# EAGLE schematic board (EAGLE 9.1.2)
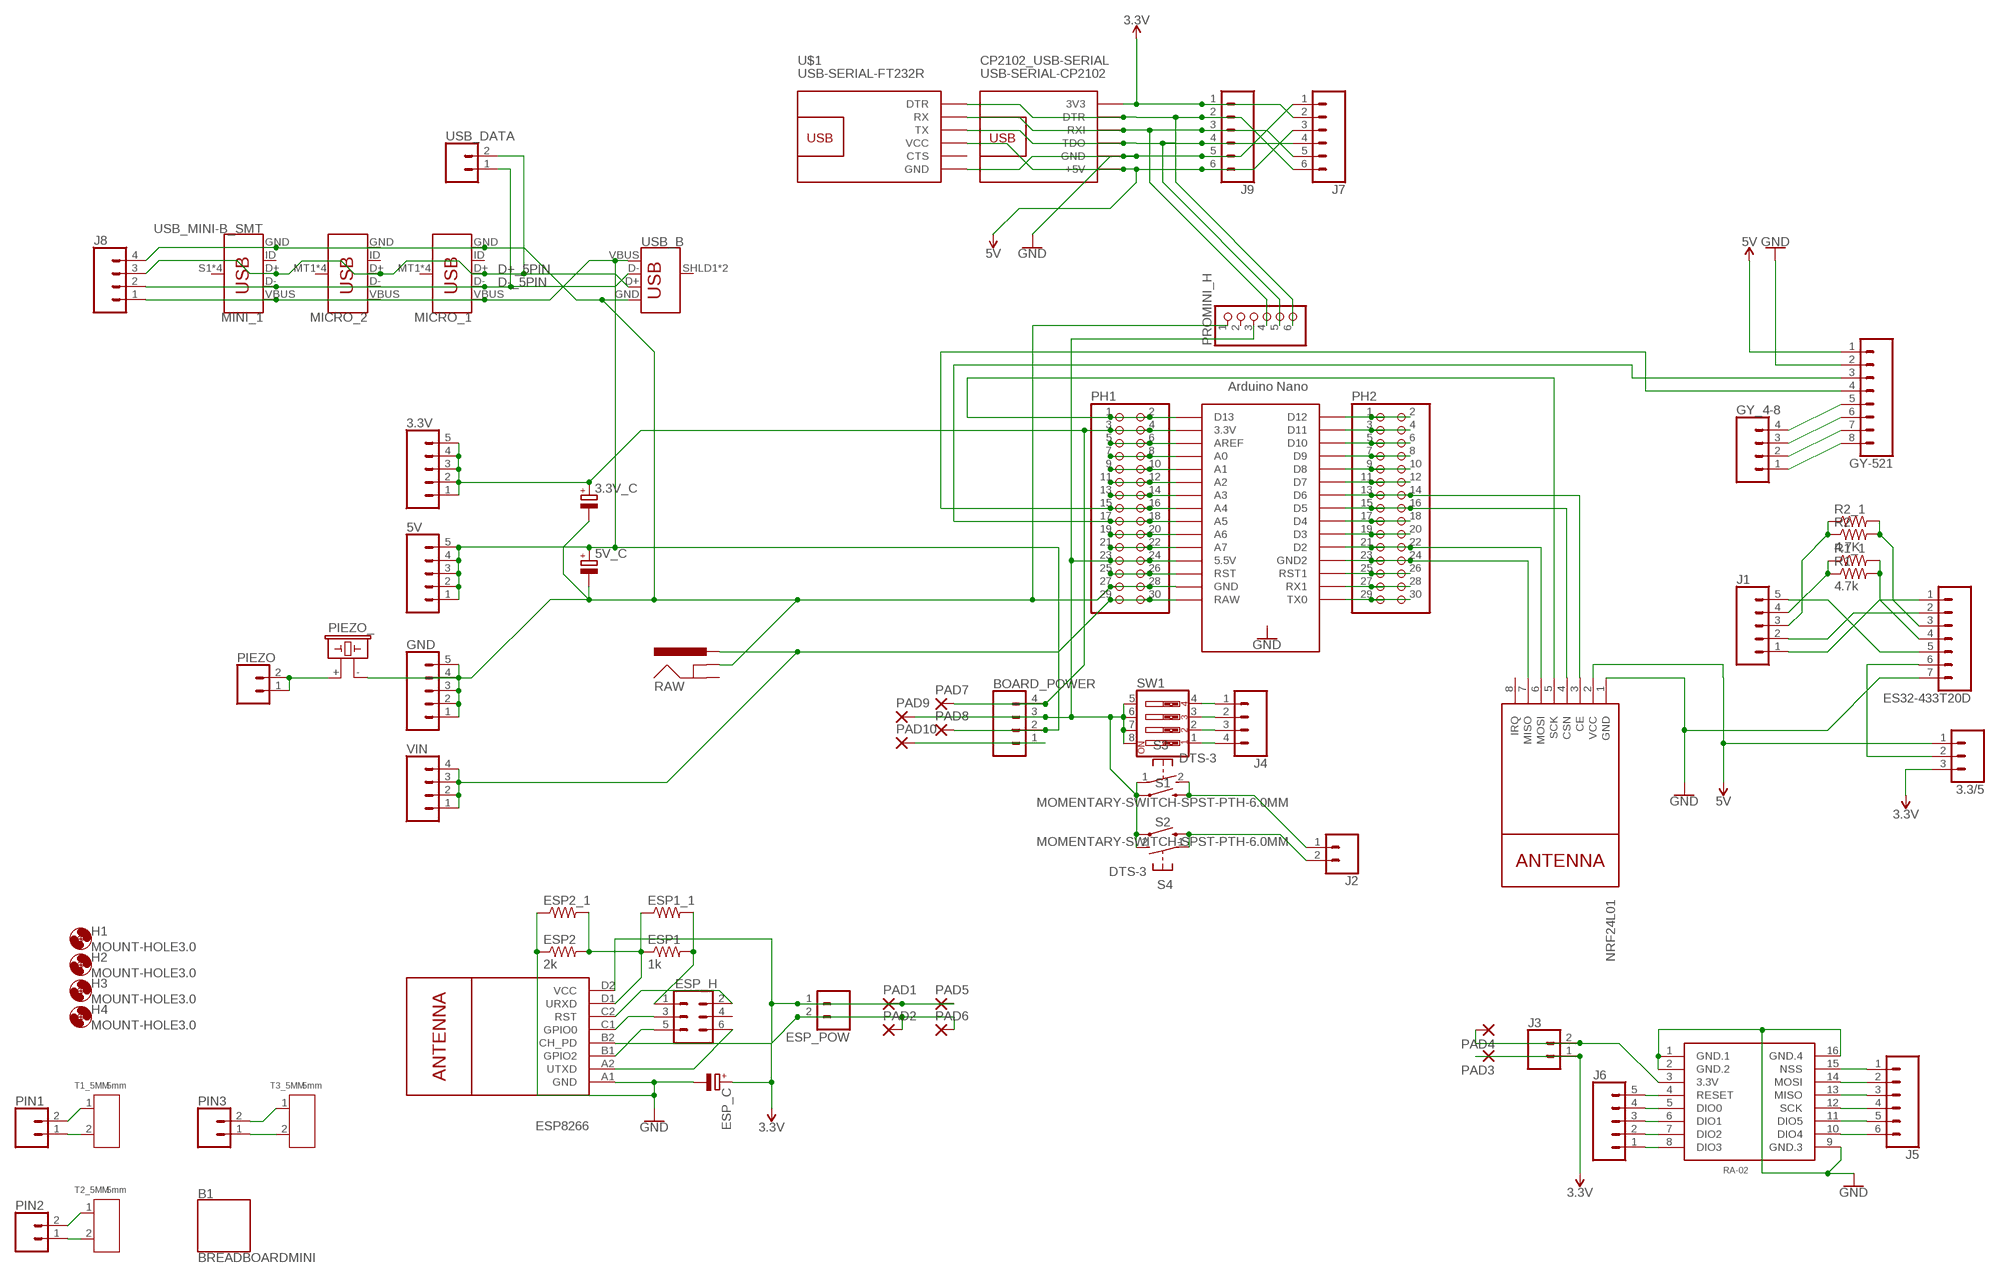
[diagram p0: schematic, sheet 1]

## Parts
3.3/5  CONN_03LOCK  [1X03_LOCK]
3.3V  CONN_05LOCK_LONGPADS  [1X05_LOCK_LONGPADS]
3.3V_C  CPOL-EUE2.5-5  [E2,5-5]
5V  CONN_05LOCK_LONGPADS  [1X05_LOCK_LONGPADS]
5V_C  CPOL-EUE3.5-8  [E3,5-8]
B1  BREADBOARDMINI  [BREADBOARD-MINI]
BOARD_POWER  CONN_04LOCK_LONGPADS  [1X04_LOCK_LONGPADS]
CP2102_USB-SERIAL  USB-SERIAL-CP2102  [USB-SERIAL-CP2102]
ES32-433T20D  CONN_07LOCK  [1X07_LOCK]
ESP1  1k  R-US_0207/7  [0207/7]
ESP1_1  R-US_R2012  [R2012]
ESP2  2k  R-US_0207/7  [0207/7]
ESP2_1  R-US_R2012  [R2012]
ESP8266  WIRELESS-WIFI-ESP-01  [WIRELESS-WIFI-ESP-01]
ESP_C  CPOL-EUE2.5-5  [E2,5-5]
ESP_H  CONN_03X2FEMALE  [2X3]
ESP_POW  CONN_02LOCK  [1X02_LOCK]
GND  CONN_05LOCK_LONGPADS  [1X05_LOCK_LONGPADS]
GY-521  CONN_08LOCK  [1X08_LOCK]
GY_4-8  CONN_04LOCK  [1X04_LOCK]
H1  MOUNT-HOLE3.0  [3,0]
H2  MOUNT-HOLE3.0  [3,0]
H3  MOUNT-HOLE3.0  [3,0]
H4  MOUNT-HOLE3.0  [3,0]
J1  CONN_05LOCK  [1X05_LOCK]
J2  CONN_02LOCK_LONGPADS  [1X02_LOCK_LONGPADS]
J3  CONN_02LOCK_LONGPADS  [1X02_LOCK_LONGPADS]
J4  CONN_04LOCK  [1X04_LOCK]
J5  CONN_06LOCK  [1X06_LOCK]
J6  CONN_05LOCK  [1X05_LOCK]
J7  CONN_06LOCK  [1X06_LOCK]
J8  CONN_04LOCK  [1X04_LOCK]
J9  CONN_06LOCK  [1X06_LOCK]
MICRO_1  USB_MICRO-B_SMT  [USB-MICROB]
MICRO_2  USB_MICRO-B_SMT  [USB-MICROB]
MINI_1  USB_MINI-B_SMT  [USB-MINIB]
NANO  NANO  [NANO]
NRF24L01  WIRELESS-NRF24L01  [WIRELESS-NRF24L01]
PAD1  SMD2  [SMD1,27-2,54]
PAD2  SMD2  [SMD1,27-2,54]
PAD3  SMD2  [SMD1,27-2,54]
PAD4  SMD2  [SMD1,27-2,54]
PAD5  SMD2  [SMD1,27-2,54]
PAD6  SMD2  [SMD1,27-2,54]
PAD7  SMD2  [SMD1,27-2,54]
PAD8  SMD2  [SMD1,27-2,54]
PAD9  SMD2  [SMD1,27-2,54]
PAD10  SMD2  [SMD1,27-2,54]
PH1  PINHD-2X15  [2X15]
PH2  PINHD-2X15  [2X15]
PIEZO  CONN_02LOCK  [1X02_LOCK]
PIEZO_  F/CM12P  [F/CM12P]
PIN1  CONN_02LOCK  [1X02_LOCK]
PIN2  CONN_02LOCK  [1X02_LOCK]
PIN3  CONN_02LOCK  [1X02_LOCK]
PROMINI_H  PINHD-1X6/OCT  [1X06/OCT]
R1  4.7k  R-US_0207/7  [0207/7]
R1_1  R-US_R2012  [R2012]
R2  4.7K  R-US_0207/7  [0207/7]
R2_1  R-US_R2012  [R2012]
RA-02  LORA-RA-02-433MHZ  [LORA-RA2-SMD]
RAW  POWER_JACKSLT  [POWER_JACK_SLOT]
S1  MOMENTARY-SWITCH-SPST-PTH-6.0MM  [TACTILE_SWITCH_PTH_6.0MM]
S2  MOMENTARY-SWITCH-SPST-PTH-6.0MM  [TACTILE_SWITCH_PTH_6.0MM]
S3  DTS-3  [DTS-3]
S4  DTS-3  [DTS-3]
SW1  SW_DIP-4  [EDG-04]
T1_5MM  5mm  SCREW-TERMINAL-GREEN(2P-5.0)  [H2-5.0-10.5X8.0MM]
T2_5MM  5mm  SCREW-TERMINAL-GREEN(2P-5.0)  [H2-5.0-10.5X8.0MM]
T3_5MM  5mm  SCREW-TERMINAL-GREEN(2P-5.0)  [H2-5.0-10.5X8.0MM]
U$1  USB-SERIAL-FT232R  [USB-SERIAL-FT232R]
USB_B  USB_B_PTH  [USB-B-PTH]
USB_DATA  CONN_02LOCK  [1X02_LOCK]
VIN  CONN_04LOCK_LONGPADS  [1X04_LOCK_LONGPADS]

## Nets
3.3V [power]: 3.3/5.3 3.3V.1 3.3V.2 3.3V.3 3.3V.4 3.3V.5 3.3V_C.+ BOARD_POWER.4 CP2102_USB-SERIAL.1(3V3) ESP8266.D2(VCC) ESP_C.+ ESP_POW.1 J3.1 J7.2 J9.1 NANO.3.3V PAD1.1(P) PAD3.1(P) PAD5.1(P) PAD7.1(P) PH1.3 PH1.4
5V [power]: 3.3/5.1 5V.1 5V.2 5V.3 5V.4 5V.5 5V_C.+ BOARD_POWER.2 CP2102_USB-SERIAL.6(+5V) GY-521.1 J7.3 J8.1 J9.6 MICRO_1.VBUS MICRO_2.VBUS MINI_1.VBUS NRF24L01.2(VCC) PAD8.1(P) U$1.4(VCC) USB_B.VBUS
A5: GY-521.3 NANO.A5 PH1.17 PH1.18
A6: NANO.A6 PH1.19 PH1.20
A7: NANO.A7 PH1.21 PH1.22
CE_NRF: NANO.D6 NRF24L01.3(CE) PH2.13 PH2.14
CSN_NRF: NANO.D5 NRF24L01.4(CSN) PH2.15 PH2.16
D+_5PIN: J8.3 MICRO_1.D+ MICRO_2.D+ MINI_1.D+ USB_B.D+ USB_DATA.2
D-_5PIN: J8.2 MICRO_1.D- MICRO_2.D- MINI_1.D- USB_B.D- USB_DATA.1
GND [power]: 3.3V_C.- 5V_C.- CP2102_USB-SERIAL.5(GND) ES32-433T20D.7 ESP2.1 ESP2_1.1 ESP8266.A1(GND) ESP_C.- GY-521.2 J7.1 J8.4 J9.5 MICRO_1.GND MICRO_2.GND MINI_1.GND NANO.GND NANO.ICSP6 NRF24L01.1(GND) PH1.27 PH1.28 PIEZO_.- PROMINI_H.1 RA-02.1(GND.1) RA-02.2(GND.2) RA-02.9(GND.3) RA-02.16(GND.4) RAW.GND@1(GNDBREAK) U$1.6(GND) USB_B.GND
MISO_NRF: NANO.GND1(GND2) NRF24L01.7(MISO) PH2.23 PH2.24
MOSI_NRF: NANO.D2 NRF24L01.6(MOSI) PH2.21 PH2.22
N$1: ES32-433T20D.2 J1.2
N$2: GY-521.5 GY_4-8.4
N$3: NANO.AREF PH1.5 PH1.6
N$4: NANO.A0 PH1.7 PH1.8
N$5: NANO.A1 PH1.9 PH1.10
N$6: NANO.A2 PH1.11 PH1.12
N$7: NANO.A3 PH1.13 PH1.14
N$8: GY-521.6 GY_4-8.3
N$9: GY-521.7 GY_4-8.2
N$10: GY-521.8 GY_4-8.1
N$11: 3.3/5.2 ES32-433T20D.6
N$12: ES32-433T20D.1 J1.1
N$13: J1.4 R1.1 R1_1.1
N$14: J1.3 R2.1 R2_1.1
N$15: ES32-433T20D.4 R1.2 R1_1.2
N$16: NANO.D12 PH2.1 PH2.2
N$17: NANO.D11 PH2.3 PH2.4
N$18: NANO.D10 PH2.5 PH2.6
N$19: NANO.D9 PH2.7 PH2.8
N$20: NANO.D8 PH2.9 PH2.10
N$21: NANO.D7 PH2.11 PH2.12
N$22: ES32-433T20D.5 J1.5
N$23 [terminal]: PIN1.2 T1_5MM.1
N$24: NANO.D4 PH2.17 PH2.18
N$25: NANO.D3 PH2.19 PH2.20
N$26 [terminal]: PIN1.1 T1_5MM.2
N$27 [terminal]: PIN2.2 T2_5MM.1
N$28: NANO.RST1 PH2.25 PH2.26
N$29: NANO.RX1 PH2.27 PH2.28
N$30: NANO.TX0 PH2.29 PH2.30
N$31 [terminal]: PIN2.1 T2_5MM.2
N$32 [terminal]: PIN3.2 T3_5MM.1
N$33 [terminal]: PIN3.1 T3_5MM.2
N$34 [power]: PIEZO.1 PIEZO.2 PIEZO_.+
N$35: GND.1 GND.2 GND.3 GND.4 GND.5
N$36 [power]: BOARD_POWER.3 NANO.5V(5.5V) PAD9.1(P) PH1.23 PH1.24 PROMINI_H.3 S1.1 S2.1 S3.1 S4.2 SW1.5 SW1.6 SW1.7 SW1.8
N$37 [power]: J2.1 S1.3 S3.2
N$38: ES32-433T20D.3 R2.2 R2_1.2
N$39 [power]: J4.1 SW1.4
N$40 [power]: J4.2 SW1.3
N$41 [power]: J4.3 SW1.2
N$42 [power]: J4.4 SW1.1
N$43 [power]: J2.2 S2.3 S4.1
N$44: J6.1 RA-02.8(DIO3)
N$45: J6.2 RA-02.7(DIO2)
N$46: J6.3 RA-02.6(DIO1)
N$47: J6.4 RA-02.5(DIO0)
N$48: J6.5 RA-02.4(RESET)
N$49: J5.1 RA-02.15(NSS)
N$50: J5.2 RA-02.14(MOSI)
N$51: J5.3 RA-02.13(MISO)
N$52: J5.4 RA-02.12(SCK)
N$53: J5.5 RA-02.11(DIO5)
N$54: J5.6 RA-02.10(DIO4)
N$55 [power]: ESP8266.B2(CH_PD) ESP_POW.2 PAD2.1(P) PAD6.1(P)
N$57: CP2102_USB-SERIAL.3(RXI) J7.5 J9.3 PROMINI_H.4 U$1.2(RX)
N$58 [power]: ESP1.1 ESP1_1.1 ESP2.2 ESP2_1.2 ESP8266.D1(URXD)
N$59: ESP8266.C2(RST) ESP_H.2
N$60: ESP8266.C1(GPIO0) ESP_H.3
N$61 [power]: ESP1.2 ESP1_1.2 ESP_H.1
N$62: CP2102_USB-SERIAL.4(TDO) J7.4 J9.4 PROMINI_H.5 U$1.3(TX)
N$63: ESP8266.B1(GPIO2) ESP_H.5
N$64: ESP8266.A2(UTXD) ESP_H.6
N$65: BOARD_POWER.1 PAD10.1(P)
N$66: CP2102_USB-SERIAL.2(DTR) J7.6 J9.2 PROMINI_H.6 U$1.1(DTR)
N$76: J3.2 PAD4.1(P) RA-02.3(3.3V)
RST: NANO.RST PH1.25 PH1.26
SCK_NRF: NANO.D13 NRF24L01.5(SCK) PH1.1 PH1.2
SDA_GY521: GY-521.4 NANO.A4 PH1.15 PH1.16
VIN [power]: NANO.RAW PH1.29 PH1.30 RAW.PWR VIN.1 VIN.2 VIN.3 VIN.4
Unconnected: ESP_H.4 MICRO_1.ID MICRO_1.MT1(SHIELD) MICRO_1.MT2(SHIELD) MICRO_1.P$1(SHIELD) MICRO_1.P$2(SHIELD) MICRO_2.ID MICRO_2.MT1(SHIELD) MICRO_2.MT2(SHIELD) MICRO_2.P$1(SHIELD) MICRO_2.P$2(SHIELD) MINI_1.ID MINI_1.S1(SHIELD) MINI_1.S2(SHIELD) MINI_1.S3(SHIELD) MINI_1.S4(SHIELD) NANO.ICSP1 NANO.ICSP2 NANO.ICSP3 NANO.ICSP4 NANO.ICSP5 NRF24L01.8(IRQ) PROMINI_H.2 RAW.GND@2(GND) U$1.5(CTS) USB_B.SHLD1(SHIELD) USB_B.SHLD2(SHIELD)

## Library data of the parts
3.3/5 = SparkFun-Connectors:CONN_03: Multi connection point. Often used as Generic Header-pin footprint for 0.1 inch spaced/style header connections On any of the 0.1 inch spaced packages, you can populate with these: Break Away Headers - Straight <https://www.sparkfun.com/products/116> (PRT-00116) Break Away Male Headers - Right Angle <https://www.sparkfun.com/products/553> (PRT-00553) Female Headers <https://www.sparkfun.com/products/115> (PRT-00115) Break Away Headers - Machine Pin <https://www.sparkfun.com/products/117> (PRT-00117) Break Away Female Headers - Swiss Machine Pin <https://www.sparkfun.com/products/743> (PRT-00743) Stackable Header - 3 Pin (Female, 0.1") <https://www.sparkfun.com/products/13875> (PRT-13875) For SCREWTERMINALS and SPRING TERMINALS visit here: Screw Terimnals on SparkFun.com <https://www.sparkfun.com/search/results?term=Screw+Terminals> (5mm/3.5mm/2.54mm spacing) This device is also useful as a general connection point to wire up your design to another part of your project. Our various solder wires solder well into these plated through hole pads. Hook-Up Wire - Assortment (Stranded, 22 AWG) <https://www.sparkfun.com/products/11375> (PRT-11375) Hook-Up Wire - Assortment (Solid Core, 22 AWG) <https://www.sparkfun.com/products/11367> (PRT-11367) View the entire wire category on our website here <https://www.sparkfun.com/categories/141> Special notes: Molex polarized connector foot print use with SKU : PRT-08232 with associated crimp pins and housings.
3.3V 5V GND J1 J6 = SparkFun-Connectors:CONN_05: Multi connection point. Often used as Generic Header-pin footprint for 0.1 inch spaced/style header connections On any of the 0.1 inch spaced packages, you can populate with these: Break Away Headers - Straight <https://www.sparkfun.com/products/116> (PRT-00116) Break Away Male Headers - Right Angle <https://www.sparkfun.com/products/553> (PRT-00553) Female Headers <https://www.sparkfun.com/products/115> (PRT-00115) Break Away Headers - Machine Pin <https://www.sparkfun.com/products/117> (PRT-00117) Break Away Female Headers - Swiss Machine Pin <https://www.sparkfun.com/products/743> (PRT-00743) For SCREWTERMINALS and SPRING TERMINALS visit here: Screw Terimnals on SparkFun.com <https://www.sparkfun.com/search/results?term=Screw+Terminals> (5mm/3.5mm/2.54mm spacing) This device is also useful as a general connection point to wire up your design to another part of your project. Our various solder wires solder well into these plated through hole pads. Hook-Up Wire - Assortment (Stranded, 22 AWG) <https://www.sparkfun.com/products/11375> (PRT-11375) Hook-Up Wire - Assortment (Solid Core, 22 AWG) <https://www.sparkfun.com/products/11367> (PRT-11367) View the entire wire category on our website here <https://www.sparkfun.com/categories/141> Special notes: Molex polarized connector foot print use with SKU : PRT-08231 with associated crimp pins and housings. 1MM SMD Version SKU: PRT-10208
3.3V_C ESP_C = rcl:CPOL-EU: POLARIZED CAPACITOR, European symbol; SPICEPREFIX: C
5V_C = resistor:CPOL-EU: POLARIZED CAPACITOR, European symbol
B1 = SparkFun-Boards:BREADBOARD: SparkFun Breadboard Mini This is the mechnical outline for the very small self adhesive breadboard from SparkFun Electronics and our prototyping breadboard of the same size. Good for very small proto areas. SparkFun Products: White <https://www.sparkfun.com/products/7916> Green <https://www.sparkfun.com/products/12046> Black <https://www.sparkfun.com/products/12047> Red <https://www.sparkfun.com/products/12044> Blue <https://www.sparkfun.com/products/12045> SparkFun Solder-able Breadboard-Mini <https://www.sparkfun.com/products/12702>; PROD_ID: COMP-12034
BOARD_POWER GY_4-8 J4 J8 VIN = SparkFun-Connectors:CONN_04: Multi connection point. Often used as Generic Header-pin footprint for 0.1 inch spaced/style header connections On any of the 0.1 inch spaced packages, you can populate with these: Break Away Headers - Straight <https://www.sparkfun.com/products/116> (PRT-00116) Break Away Male Headers - Right Angle <https://www.sparkfun.com/products/553> (PRT-00553) Female Headers <https://www.sparkfun.com/products/115> (PRT-00115) Break Away Headers - Machine Pin <https://www.sparkfun.com/products/117> (PRT-00117) Break Away Female Headers - Swiss Machine Pin <https://www.sparkfun.com/products/743> (PRT-00743) For SCREWTERMINALS and SPRING TERMINALS visit here: Screw Terimnals on SparkFun.com <https://www.sparkfun.com/search/results?term=Screw+Terminals> (5mm/3.5mm/2.54mm spacing) This device is also useful as a general connection point to wire up your design to another part of your project. Our various solder wires solder well into these plated through hole pads. Hook-Up Wire - Assortment (Stranded, 22 AWG) <https://www.sparkfun.com/products/11375> (PRT-11375) Hook-Up Wire - Assortment (Solid Core, 22 AWG) <https://www.sparkfun.com/products/11367> (PRT-11367) View the entire wire category on our website here <https://www.sparkfun.com/categories/141> Special notes: Molex polarized connector foot print use with SKU : PRT-08231 with associated crimp pins and housings. 1MM SMD Version SKU: PRT-10208; PROD_ID: CONN-09696
CP2102_USB-SERIAL = diy-modules:USB-SERIAL-CP2102: USB to Serial UART Converter based on CP2102 chip More information about CP2102 chip is available here: https://www.silabs.com/documents/public/data-sheets/CP2102-9.pdf Drivers for CP210x devices are available here: http://www.silabs.com/products/development-tools/software/usb-to-uart-bridge-vcp-drivers Click here to find device on ebay.com <http://www.ebay.com/sch/cp2102+micro+usb>
ES32-433T20D = SparkFun-Connectors:CONN_07: Multi connection point. Often used as Generic Header-pin footprint for 0.1 inch spaced/style header connections On any of the 0.1 inch spaced packages, you can populate with these: Break Away Headers - Straight <https://www.sparkfun.com/products/116> (PRT-00116) Break Away Male Headers - Right Angle <https://www.sparkfun.com/products/553> (PRT-00553) Female Headers <https://www.sparkfun.com/products/115> (PRT-00115) Break Away Headers - Machine Pin <https://www.sparkfun.com/products/117> (PRT-00117) Break Away Female Headers - Swiss Machine Pin <https://www.sparkfun.com/products/743> (PRT-00743) For SCREWTERMINALS and SPRING TERMINALS visit here: Screw Terimnals on SparkFun.com <https://www.sparkfun.com/search/results?term=Screw+Terminals> (5mm/3.5mm/2.54mm spacing) This device is also useful as a general connection point to wire up your design to another part of your project. Our various solder wires solder well into these plated through hole pads. Hook-Up Wire - Assortment (Stranded, 22 AWG) <https://www.sparkfun.com/products/11375> (PRT-11375) Hook-Up Wire - Assortment (Solid Core, 22 AWG) <https://www.sparkfun.com/products/11367> (PRT-11367) View the entire wire category on our website here <https://www.sparkfun.com/categories/141> Special notes: Molex polarized connector foot print use with SKU : PRT-08231 with associated crimp pins and housings. 1MM SMD Version SKU: PRT-10208 NOTES ON THE VARIANTS LOCK and LOCK_LONGPADS... This footprint was designed to help hold the alignment of a through-hole component (i.e. 6-pin header) while soldering it into place. You may notice that each hole has been shifted either up or down by 0.005 of an inch from it's more standard position (which is a perfectly straight line). This slight alteration caused the pins (the squares in the middle) to touch the edges of the holes. Because they are alternating, it causes a "brace" to hold the component in place. 0.005 has proven to be the perfect amount of "off-center" position when using our standard breakaway headers. Although looks a little odd when you look at the bare footprint, once you have a header in there, the alteration is very hard to notice. Also,if you push a header all the way into place, it is covered up entirely on the bottom side.
ESP1 ESP1_1 ESP2 ESP2_1 R1 R1_1 R2 R2_1 = rcl:R-US_: RESISTOR, American symbol; SPICEPREFIX: R
ESP8266 = diy-modules:WIRELESS-WIFI-ESP-01: Wireless Wi-Fi ESP-01 Module based on ESP8266 chip Click here to find device on ebay.com <http://www.ebay.com/sch/esp8266+esp+01+transceiver>
ESP_H = SparkFun-Connectors:CONN_03X2: Multi connection point. Often used as Generic Header-pin footprint for 0.1 inch spaced/style header connections You can populate with any combo of single row headers, but if you'd like an exact match, check these: Header - 2x3 (Male, 0.1") <https://www.sparkfun.com/products/12807> (PRT-12807) Header - 2x3 (Female, 0.1") <https://www.sparkfun.com/products/13010> (PRT-13010) 2x3 Pin Shrouded Header <https://www.sparkfun.com/products/10877> (PRT-10877) On any of the 0.1 inch spaced packages, you can populate with these: Break Away Headers - Straight <https://www.sparkfun.com/products/116> (PRT-00116) Break Away Male Headers - Right Angle <https://www.sparkfun.com/products/553> (PRT-00553) Female Headers <https://www.sparkfun.com/products/115> (PRT-00115) Break Away Headers - Machine Pin <https://www.sparkfun.com/products/117> (PRT-00117) Break Away Female Headers - Swiss Machine Pin <https://www.sparkfun.com/products/743> (PRT-00743) Special note: the shrouded connector mates well with our 3x2 ribbon cables: Ribbon Crimp Connector - 6-pin (2x3, Female) <https://www.sparkfun.com/products/10651> (PRT-10651) Ribbon Cable - 6 wire (15ft) <https://www.sparkfun.com/products/10646> (PRT-10646); PROD_ID: CONN-11566; VALUE: FEMALE 2x3
ESP_POW J2 J3 PIEZO PIN1-PIN3 USB_DATA = SparkFun-Connectors:CONN_02: Multi connection point. Often used as Generic Header-pin footprint for 0.1 inch spaced/style header connections On any of the 0.1 inch spaced packages, you can populate with these: Break Away Headers - Straight <https://www.sparkfun.com/products/116> (PRT-00116) Break Away Male Headers - Right Angle <https://www.sparkfun.com/products/553> (PRT-00553) Female Headers <https://www.sparkfun.com/products/115> (PRT-00115) Break Away Headers - Machine Pin <https://www.sparkfun.com/products/117> (PRT-00117) Break Away Female Headers - Swiss Machine Pin <https://www.sparkfun.com/products/743> (PRT-00743) For SCREWTERMINALS and SPRING TERMINALS visit here: Screw Terimnals on SparkFun.com <https://www.sparkfun.com/search/results?term=Screw+Terminals> (5mm/3.5mm/2.54mm spacing) This device is also useful as a general connection point to wire up your design to another part of your project. Our various solder wires solder well into these plated through hole pads. Hook-Up Wire - Assortment (Stranded, 22 AWG) <https://www.sparkfun.com/products/11375> (PRT-11375) Hook-Up Wire - Assortment (Solid Core, 22 AWG) <https://www.sparkfun.com/products/11367> (PRT-11367) View the entire wire category on our website here <https://www.sparkfun.com/categories/141> Special notes: Molex polarized connector foot print use with: PRT-08233 with associated crimp pins and housings. 2.54_SCREWTERM for use with PRT-10571. 3.5mm Screw Terminal footprints for PRT-08084 5mm Screw Terminal footprints for use with PRT-08432
GY-521 = SparkFun-Connectors:CONN_08: Multi connection point. Often used as Generic Header-pin footprint for 0.1 inch spaced/style header connections On any of the 0.1 inch spaced packages, you can populate with these: Break Away Headers - Straight <https://www.sparkfun.com/products/116> (PRT-00116) Break Away Male Headers - Right Angle <https://www.sparkfun.com/products/553> (PRT-00553) Female Headers <https://www.sparkfun.com/products/115> (PRT-00115) Break Away Headers - Machine Pin <https://www.sparkfun.com/products/117> (PRT-00117) Break Away Female Headers - Swiss Machine Pin <https://www.sparkfun.com/products/743> (PRT-00743) Arduino Stackable Header - 8 Pin <https://www.sparkfun.com/products/9279> (PRT-09279) For SCREWTERMINALS and SPRING TERMINALS visit here: Screw Terimnals on SparkFun.com <https://www.sparkfun.com/search/results?term=Screw+Terminals> (5mm/3.5mm/2.54mm spacing) This device is also useful as a general connection point to wire up your design to another part of your project. Our various solder wires solder well into these plated through hole pads. Hook-Up Wire - Assortment (Stranded, 22 AWG) <https://www.sparkfun.com/products/11375> (PRT-11375) Hook-Up Wire - Assortment (Solid Core, 22 AWG) <https://www.sparkfun.com/products/11367> (PRT-11367) View the entire wire category on our website here <https://www.sparkfun.com/categories/141> Special notes: Molex polarized connector foot print use with SKU : PRT-08231 with associated crimp pins and housings. 1MM SMD Version SKU: PRT-10208 NOTES ON THE VARIANTS LOCK and LOCK_LONGPADS... This footprint was designed to help hold the alignment of a through-hole component (i.e. 6-pin header) while soldering it into place. You may notice that each hole has been shifted either up or down by 0.005 of an inch from it's more standard position (which is a perfectly straight line). This slight alteration caused the pins (the squares in the middle) to touch the edges of the holes. Because they are alternating, it causes a "brace" to hold the component in place. 0.005 has proven to be the perfect amount of "off-center" position when using our standard breakaway headers. Although looks a little odd when you look at the bare footprint, once you have a header in there, the alteration is very hard to notice. Also,if you push a header all the way into place, it is covered up entirely on the bottom side.
H1-H4 = holes:MOUNT-HOLE: MOUNTING HOLE with drill center marker
J5 J7 J9 = SparkFun-Connectors:CONN_06: Multi connection point. Often used as Generic Header-pin footprint for 0.1 inch spaced/style header connections On any of the 0.1 inch spaced packages, you can populate with these: Break Away Headers - Straight <https://www.sparkfun.com/products/116> (PRT-00116) Break Away Male Headers - Right Angle <https://www.sparkfun.com/products/553> (PRT-00553) Female Headers <https://www.sparkfun.com/products/115> (PRT-00115) Break Away Headers - Machine Pin <https://www.sparkfun.com/products/117> (PRT-00117) Break Away Female Headers - Swiss Machine Pin <https://www.sparkfun.com/products/743> (PRT-00743) Arduino Stackable Header - 6 Pin <https://www.sparkfun.com/products/9280> (PRT-09280) For SCREWTERMINALS and SPRING TERMINALS visit here: Screw Terimnals on SparkFun.com <https://www.sparkfun.com/search/results?term=Screw+Terminals> (5mm/3.5mm/2.54mm spacing) This device is also useful as a general connection point to wire up your design to another part of your project. Our various solder wires solder well into these plated through hole pads. Hook-Up Wire - Assortment (Stranded, 22 AWG) <https://www.sparkfun.com/products/11375> (PRT-11375) Hook-Up Wire - Assortment (Solid Core, 22 AWG) <https://www.sparkfun.com/products/11367> (PRT-11367) View the entire wire category on our website here <https://www.sparkfun.com/categories/141>
MICRO_1 MICRO_2 = SparkFun-Connectors:USB_MICRO-B: USB Type Micro-B Connector Male/female and PTH/SMT variants SparkFun Products: SparkFun microB USB Breakout <https://www.sparkfun.com/products/12035> SparkFun USB microB Plug Breakout <https://www.sparkfun.com/products/10031> SparkFun ESP8266 Thing <https://www.sparkfun.com/products/13231>; PROD_ID: CONN-09505; SF_ID: PRT-08533
MINI_1 = SparkFun-Connectors:USB_MINI-B: USB type Mini-B Connector Breaks out 5th pin, and includes shield pins if needed. SparkFun Products: SparkFun FTDI Basic Breakout <https://www.sparkfun.com/products/9716> SparkFun XBee Explorer USB <https://www.sparkfun.com/products/11812> SparkFun Redboard <https://www.sparkfun.com/products/12757>; PROD_ID: CONN-08193; SF_ID: PRT-00587
NANO = Arduino-clone:NANO: Arduino Nano
NRF24L01 = diy-modules:WIRELESS-NRF24L01: 2.4 GHz Wireless Module based on NRF24L01 chip More details available here: http://www.electrodragon.com/w/NRF24L01 Click here to find device on ebay.com <http://www.ebay.com/sch/nrf24l01+arduino>
PAD1-PAD10 = wirepad:SMD2: SMD PAD
PH1 PH2 = pinhead:PINHD-2X15: PIN HEADER
PIEZO_ = buzzer:F/CM12P: BUZZER Source: Buerklin; OC_FARNELL: unknown; OC_NEWARK: unknown
PROMINI_H = pinhead_v2:PINHD-1X6: PIN HEADER
RA-02 = LikeCircuit:LORA-RA-02-433MHZ: 433 MHz Lora Ra-02 Radio Transceiver Module based on SX1276 chip. Visit our more eagle PCB <https://www.likecircuit.com/>
RAW = SparkFun-Connectors:POWER_JACK: Power Jack Connector This is the standard 5.5mm barrel jack for power. The PTH is the most common, proven, reliable, footprint. The Slot footprint only works if the mill layer is transmitted to the PCB fab house so be warned. Here are the connectors we sell at SparkFun: DC Barrel Power Jack/Connector <https://www.sparkfun.com/products/119> (PRT-00119) DC Barrel Power Jack/Connector (SMD) <https://www.sparkfun.com/products/12748> (PRT-12748) DC Barrel Jack Adapter - Breadboard Compatible <https://www.sparkfun.com/products/10811> (PRT-10811) It is used on this SparkFun product (and many, many others): SparkFun RedBoard - Programmed with Arduino <https://www.sparkfun.com/products/12757> (DEV-12757) Also, if you need a mating power supply or connector, please check these out: Wall Adapter Power Supply - 9VDC 650mA <https://www.sparkfun.com/products/298> (TOL-00298) DC Barrel Jack Adapter - Male <https://www.sparkfun.com/products/10287> (PRT-10287); PROD_ID: PRT-00119
S1 S2 = SparkFun-Switches:MOMENTARY-SWITCH-SPST: Momentary Switch (Pushbutton) - SPST Normally-open (NO) SPST momentary switches (buttons, pushbuttons). Variants PTH-12MM - 12mm square, through-hole Momentary Pushbutton Switch - 12mm Square <https://www.sparkfun.com/products/9190> (COM-09190) PTH-6.0MM, PTH-6.0MM-KIT - 6.0mm square, through-hole Mini Pushbutton Switch <https://www.sparkfun.com/products/97> (COM-00097) KIT package intended for soldering kit's - only one side of pads' copper is exposed. PTH-RIGHT-ANGLE-KIT - Right-angle, through-hole Right Angle Tactile Button <https://www.sparkfun.com/products/10791> - Used on SparkFun BigTime Watch Kit <https://www.sparkfun.com/products/11734> SMD-12MM - 12mm square, surface-mount Tactile Button - SMD (12mm) <https://www.sparkfun.com/products/12993> (COM-12993) Used on SparkFun PicoBoard <https://www.sparkfun.com/products/11888> SMD-4.5MM - 4.5mm Square Trackball Switch Used on SparkFun Blackberry Trackballer Breakout <https://www.sparkfun.com/products/13169> SMD-4.6MMX2.8MM - 4.60mm x 2.80mm, surface mount Used on SparkFun SAMD21 Mini Breakout <https://www.sparkfun.com/products/13664> SMD-5.2MM, SMD-5.2-REDUNDANT - 5.2mm square, surface-mount Mini Pushbutton Switch - SMD <https://www.sparkfun.com/products/8720> (COM-08720) Used on Arduino Pro Mini <https://www.sparkfun.com/products/11114> REDUNDANT package connects both switch circuits together SMD-6.0X3.5MM - 6.0 x 3.5mm, surface mount Momentary Reset Switch SMD <https://www.sparkfun.com/products/8229> (COM-08229) SMD-6.2MM-TALL - 6.2mm square, surface mount Tactile Button - SMD (6mm) <https://www.sparkfun.com/products/12992> Used on SparkFun Digital Sandbox <https://www.sparkfun.com/products/12651> SMD-RIGHT-ANGLE - Right-angle, surface mount Used on SparkFun Block for Intel® Edison - Arduino <https://www.sparkfun.com/products/13036>; PROD_ID: SWCH-08441; SF_SKU: COM-00097
S3 S4 = switch-tact:DTS-3
SW1 = special:SW_DIP-4: DIP SWITCH
T1_5MM T2_5MM T3_5MM = Seeed-Connector:SCREW-TERMINAL-GREEN(2P-5.0): 320110031; VALUE: GREEN-2P-5.0
U$1 = diy-modules:USB-SERIAL-FT232R: USB to Serial UART Converter based on FT232R chip More information about FT232R chip is available here: http://www.ftdichip.com/Products/ICs/FT232R.htm Click here to find device on ebay.com <http://www.ebay.com/sch/ft232rl+arduino+download+max232>
USB_B = SparkFun-Connectors:USB_B: USB Type B Connector SparkFun Products: SparkFun Stepoko <https://www.sparkfun.com/products/13899> PTH; PROD_ID: CONN-08278; SF_ID: PRT-00139

## Net classes
0 default: width 0.203 mm, drill 0.127 mm, clearance 0.152 mm
1 power: width 0.762 mm, clearance 0.254 mm
2 terminal: width 2.159 mm, clearance 0.305 mm